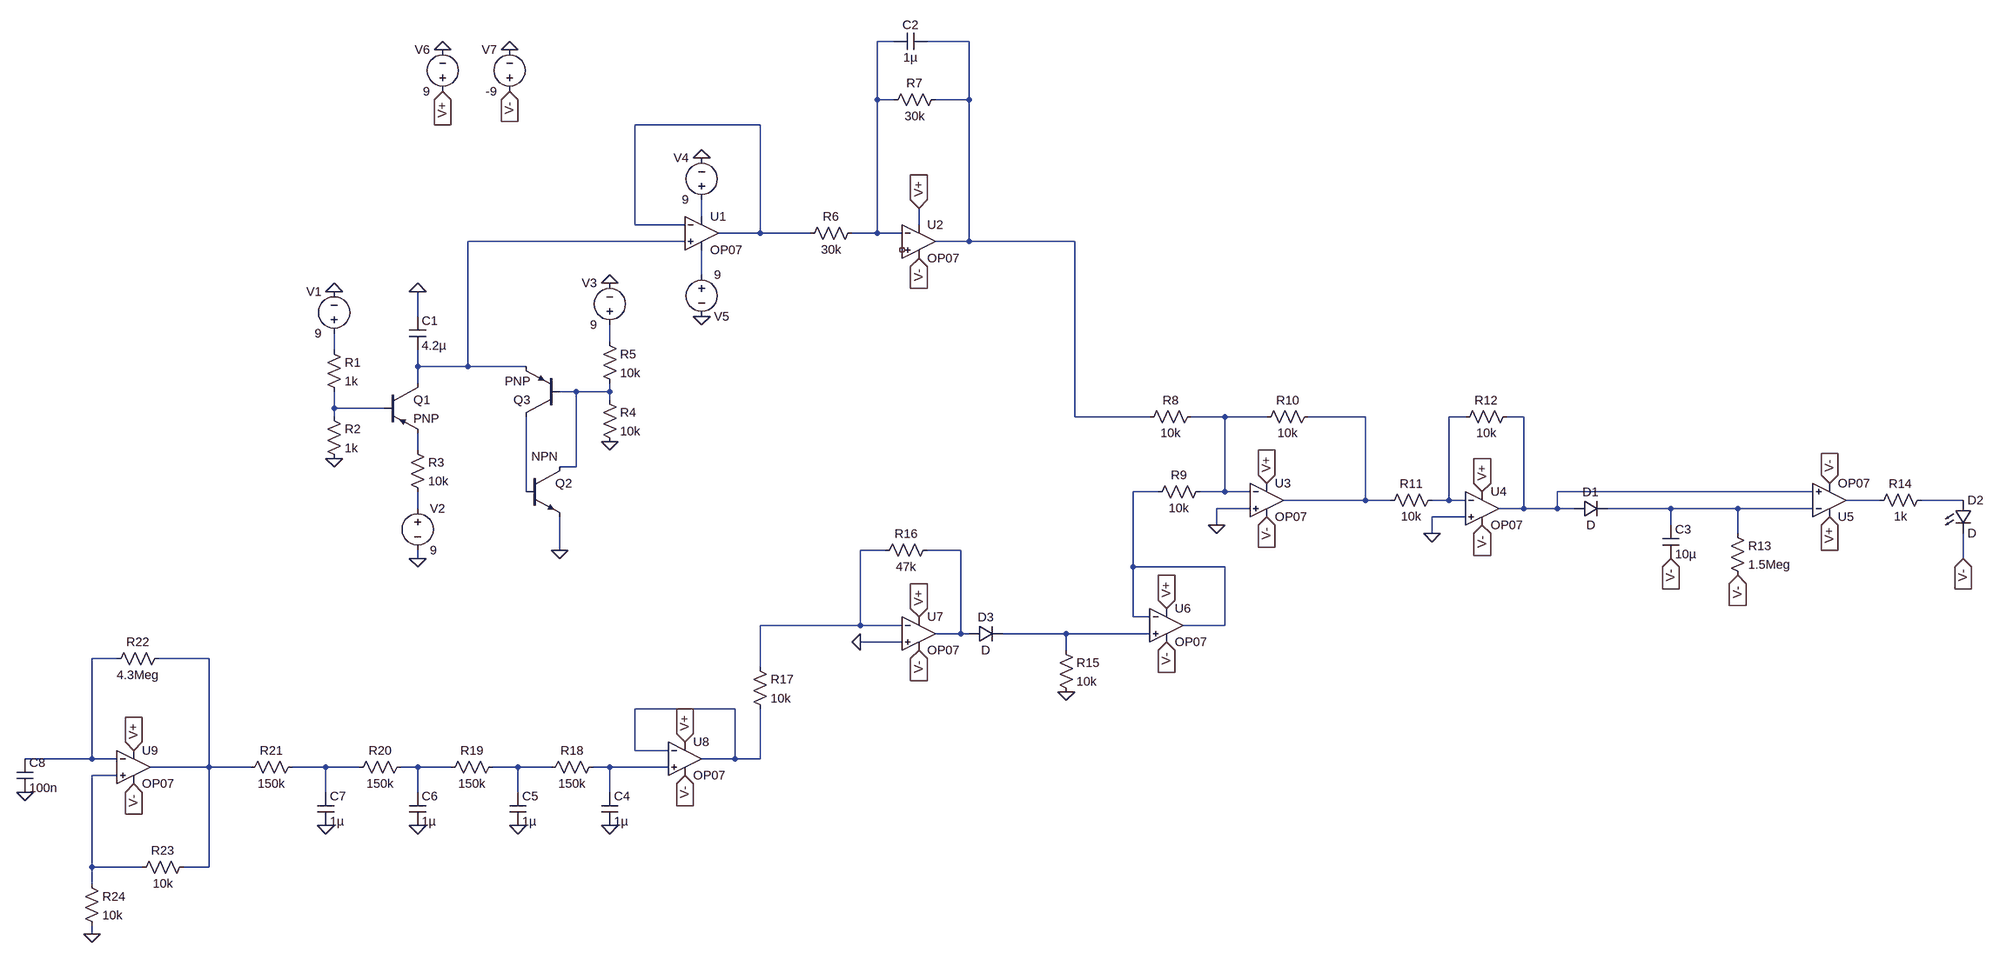
[diagram p0: schematic PulseSim.asc]
PulseSim.asc, the LTspice schematic file:
Version 4
SHEET 1 3496 1556
WIRE 1344 -176 1312 -176
WIRE 1488 -176 1408 -176
WIRE 1312 -64 1312 -176
WIRE 1344 -64 1312 -64
WIRE 1488 -64 1488 -176
WIRE 1488 -64 1424 -64
WIRE 1088 -16 848 -16
WIRE 976 160 976 128
WIRE 848 176 848 -16
WIRE 944 176 848 176
WIRE 1392 176 1392 144
WIRE 1088 192 1088 -16
WIRE 1088 192 1008 192
WIRE 1184 192 1088 192
WIRE 1312 192 1312 -64
WIRE 1312 192 1264 192
WIRE 1360 192 1312 192
WIRE 944 208 528 208
WIRE 1488 208 1488 -64
WIRE 1488 208 1424 208
WIRE 1712 208 1488 208
WIRE 976 272 976 224
WIRE 432 352 432 304
WIRE 800 400 800 368
WIRE 272 416 272 384
WIRE 432 448 432 416
WIRE 528 448 528 208
WIRE 528 448 432 448
WIRE 640 448 528 448
WIRE 432 480 432 448
WIRE 736 496 704 496
WIRE 800 496 800 480
WIRE 800 496 736 496
WIRE 800 512 800 496
WIRE 272 528 272 496
WIRE 368 528 272 528
WIRE 272 544 272 528
WIRE 1712 544 1712 208
WIRE 1856 544 1712 544
WIRE 2000 544 1936 544
WIRE 2080 544 2000 544
WIRE 2272 544 2160 544
WIRE 2464 544 2432 544
WIRE 2576 544 2544 544
WIRE 432 608 432 576
WIRE 736 640 736 496
WIRE 736 640 704 640
WIRE 640 688 640 544
WIRE 1872 688 1824 688
WIRE 2000 688 2000 544
WIRE 2000 688 1952 688
WIRE 2048 688 2000 688
WIRE 3136 688 2640 688
WIRE 2272 704 2272 544
WIRE 2272 704 2112 704
WIRE 2320 704 2272 704
WIRE 2432 704 2432 544
WIRE 2432 704 2400 704
WIRE 2464 704 2432 704
WIRE 3264 704 3200 704
WIRE 3424 704 3344 704
WIRE 432 720 432 688
WIRE 2048 720 1984 720
WIRE 2576 720 2576 544
WIRE 2576 720 2528 720
WIRE 2640 720 2640 688
WIRE 2640 720 2576 720
WIRE 2672 720 2640 720
WIRE 2864 720 2736 720
WIRE 2992 720 2864 720
WIRE 3136 720 2992 720
WIRE 2464 736 2400 736
WIRE 1984 752 1984 720
WIRE 2864 752 2864 720
WIRE 2400 768 2400 736
WIRE 2992 768 2992 720
WIRE 704 800 704 736
WIRE 1328 800 1280 800
WIRE 1472 800 1408 800
WIRE 432 816 432 800
WIRE 3424 816 3424 768
WIRE 1824 832 1824 688
WIRE 2000 832 1824 832
WIRE 1824 928 1824 832
WIRE 1856 928 1824 928
WIRE 1280 944 1280 800
WIRE 1280 944 1088 944
WIRE 1360 944 1280 944
WIRE 2000 944 2000 832
WIRE 2000 944 1920 944
WIRE 1472 960 1472 800
WIRE 1472 960 1424 960
WIRE 1488 960 1472 960
WIRE 1696 960 1552 960
WIRE 1856 960 1696 960
WIRE 1360 976 1280 976
WIRE 1696 992 1696 960
WIRE -144 1008 -192 1008
WIRE 32 1008 -64 1008
WIRE 1088 1024 1088 944
WIRE 1040 1104 848 1104
WIRE 848 1184 848 1104
WIRE 912 1184 848 1184
WIRE -192 1200 -192 1008
WIRE -192 1200 -320 1200
WIRE -144 1200 -192 1200
WIRE 1040 1200 1040 1104
WIRE 1040 1200 976 1200
WIRE 1088 1200 1088 1104
WIRE 1088 1200 1040 1200
WIRE 32 1216 32 1008
WIRE 32 1216 -80 1216
WIRE 112 1216 32 1216
WIRE 256 1216 192 1216
WIRE 320 1216 256 1216
WIRE 432 1216 400 1216
WIRE 496 1216 432 1216
WIRE 624 1216 576 1216
WIRE 688 1216 624 1216
WIRE 800 1216 768 1216
WIRE 912 1216 800 1216
WIRE -144 1232 -192 1232
WIRE 256 1264 256 1216
WIRE 432 1264 432 1216
WIRE 624 1264 624 1216
WIRE 800 1264 800 1216
WIRE -192 1408 -192 1232
WIRE -96 1408 -192 1408
WIRE 32 1408 32 1216
WIRE 32 1408 -16 1408
WIRE -192 1440 -192 1408
WIRE -192 1536 -192 1520
FLAG 272 304 0
FLAG 272 624 0
FLAG 432 816 0
FLAG 432 304 0
FLAG 704 800 0
FLAG 800 288 0
FLAG 800 592 0
FLAG 976 48 0
FLAG 976 352 0
FLAG 1392 144 V+
IOPIN 1392 144 In
FLAG 480 -80 V+
IOPIN 480 -80 In
FLAG 480 -160 0
FLAG 2080 672 V+
IOPIN 2080 672 In
FLAG 1984 752 0
FLAG 2400 768 0
FLAG 2496 688 V+
IOPIN 2496 688 In
FLAG 608 -80 V-
IOPIN 608 -80 In
FLAG 608 -160 0
FLAG 1392 240 V-
IOPIN 1392 240 In
FLAG 2080 736 V-
IOPIN 2080 736 In
FLAG 2496 752 V-
IOPIN 2496 752 In
FLAG 2864 816 V-
IOPIN 2864 816 In
FLAG 2992 848 V-
IOPIN 2992 848 In
FLAG 3168 672 V-
IOPIN 3168 672 In
FLAG 3168 736 V+
IOPIN 3168 736 In
FLAG 3424 816 V-
IOPIN 3424 816 In
FLAG 1888 912 V+
IOPIN 1888 912 In
FLAG 1888 976 V-
IOPIN 1888 976 In
FLAG 1696 1072 0
FLAG 1392 928 V+
IOPIN 1392 928 In
FLAG 1392 992 V-
IOPIN 1392 992 In
FLAG 1280 976 0
FLAG 944 1168 V+
IOPIN 944 1168 In
FLAG 944 1232 V-
IOPIN 944 1232 In
FLAG 800 1328 0
FLAG 432 1328 0
FLAG 256 1328 0
FLAG 624 1328 0
FLAG -112 1184 V+
IOPIN -112 1184 In
FLAG -112 1248 V-
IOPIN -112 1248 In
FLAG -192 1536 0
FLAG -320 1264 0
SYMBOL voltage 272 400 R180
WINDOW 0 24 96 Left 2
WINDOW 3 24 16 Left 2
WINDOW 123 0 0 Left 0
WINDOW 39 0 0 Left 0
SYMATTR InstName V1
SYMATTR Value 9
SYMBOL res 256 400 R0
SYMATTR InstName R1
SYMATTR Value 1k
SYMBOL res 256 528 R0
SYMATTR InstName R2
SYMATTR Value 1k
SYMBOL pnp 368 480 R0
SYMATTR InstName Q1
SYMBOL res 416 592 R0
SYMATTR InstName R3
SYMATTR Value 10k
SYMBOL voltage 432 704 R0
WINDOW 123 0 0 Left 0
WINDOW 39 0 0 Left 0
SYMATTR InstName V2
SYMATTR Value 9
SYMBOL cap 416 352 R0
SYMATTR InstName C1
SYMATTR Value 4.2µ
SYMBOL npn 640 640 R0
WINDOW 3 10 -20 Left 2
SYMATTR InstName Q2
SYMBOL pnp2 704 544 R180
SYMATTR InstName Q3
SYMBOL res 784 496 R0
SYMATTR InstName R4
SYMATTR Value 10k
SYMBOL res 784 384 R0
SYMATTR InstName R5
SYMATTR Value 10k
SYMBOL voltage 800 384 R180
WINDOW 0 24 96 Left 2
WINDOW 3 24 16 Left 2
WINDOW 123 0 0 Left 0
WINDOW 39 0 0 Left 0
SYMATTR InstName V3
SYMATTR Value 9
SYMBOL Opamps\\OP07 976 128 R0
SYMATTR InstName U1
SYMBOL voltage 976 144 R180
WINDOW 0 24 96 Left 2
WINDOW 3 24 16 Left 2
WINDOW 123 0 0 Left 0
WINDOW 39 0 0 Left 0
SYMATTR InstName V4
SYMATTR Value 9
SYMBOL voltage 976 256 R0
WINDOW 0 24 96 Left 2
WINDOW 3 24 16 Left 2
WINDOW 123 0 0 Left 0
WINDOW 39 0 0 Left 0
SYMATTR InstName V5
SYMATTR Value 9
SYMBOL res 1280 176 R90
WINDOW 0 0 56 VBottom 2
WINDOW 3 32 56 VTop 2
SYMATTR InstName R6
SYMATTR Value 30k
SYMBOL Opamps\\OP07 1392 144 R0
SYMATTR InstName U2
SYMBOL res 1440 -80 R90
WINDOW 0 0 56 VBottom 2
WINDOW 3 32 56 VTop 2
SYMATTR InstName R7
SYMATTR Value 30k
SYMBOL cap 1408 -192 R90
WINDOW 0 0 32 VBottom 2
WINDOW 3 32 32 VTop 2
SYMATTR InstName C2
SYMATTR Value 1µ
SYMBOL voltage 480 -64 R180
WINDOW 0 24 96 Left 2
WINDOW 3 24 16 Left 2
WINDOW 123 0 0 Left 0
WINDOW 39 0 0 Left 0
SYMATTR InstName V6
SYMATTR Value 9
SYMBOL res 1952 528 R90
WINDOW 0 0 56 VBottom 2
WINDOW 3 32 56 VTop 2
SYMATTR InstName R8
SYMATTR Value 10k
SYMBOL Opamps\\OP07 2080 640 R0
SYMATTR InstName U3
SYMBOL res 1968 672 R90
WINDOW 0 0 56 VBottom 2
WINDOW 3 32 56 VTop 2
SYMATTR InstName R9
SYMATTR Value 10k
SYMBOL res 2176 528 R90
WINDOW 0 0 56 VBottom 2
WINDOW 3 32 56 VTop 2
SYMATTR InstName R10
SYMATTR Value 10k
SYMBOL res 2416 688 R90
WINDOW 0 0 56 VBottom 2
WINDOW 3 32 56 VTop 2
SYMATTR InstName R11
SYMATTR Value 10k
SYMBOL Opamps\\OP07 2496 656 R0
SYMATTR InstName U4
SYMBOL res 2560 528 R90
WINDOW 0 0 56 VBottom 2
WINDOW 3 32 56 VTop 2
SYMATTR InstName R12
SYMATTR Value 10k
SYMBOL diode 2672 736 R270
WINDOW 0 32 32 VTop 2
WINDOW 3 0 32 VBottom 2
SYMATTR InstName D1
SYMBOL cap 2848 752 R0
SYMATTR InstName C3
SYMATTR Value 10µ
SYMBOL res 2976 752 R0
SYMATTR InstName R13
SYMATTR Value 1.5Meg
SYMBOL voltage 608 -64 R180
WINDOW 0 24 96 Left 2
WINDOW 3 24 16 Left 2
WINDOW 123 0 0 Left 0
WINDOW 39 0 0 Left 0
SYMATTR InstName V7
SYMATTR Value -9
SYMBOL Opamps\\OP07 3168 768 M180
SYMATTR InstName U5
SYMBOL res 3360 688 R90
WINDOW 0 0 56 VBottom 2
WINDOW 3 32 56 VTop 2
SYMATTR InstName R14
SYMATTR Value 1k
SYMBOL LED 3408 704 R0
SYMATTR InstName D2
SYMBOL Opamps\\OP07 1888 880 R0
SYMATTR InstName U6
SYMBOL res 1680 976 R0
SYMATTR InstName R15
SYMATTR Value 10k
SYMBOL diode 1488 976 R270
WINDOW 0 32 32 VTop 2
WINDOW 3 0 32 VBottom 2
SYMATTR InstName D3
SYMBOL Opamps\\OP07 1392 896 R0
SYMATTR InstName U7
SYMBOL res 1424 784 R90
WINDOW 0 0 56 VBottom 2
WINDOW 3 32 56 VTop 2
SYMATTR InstName R16
SYMATTR Value 47k
SYMBOL res 1072 1008 R0
SYMATTR InstName R17
SYMATTR Value 10k
SYMBOL Opamps\\OP07 944 1136 R0
SYMATTR InstName U8
SYMBOL cap 784 1264 R0
SYMATTR InstName C4
SYMATTR Value 1µ
SYMBOL cap 608 1264 R0
SYMATTR InstName C5
SYMATTR Value 1µ
SYMBOL cap 416 1264 R0
SYMATTR InstName C6
SYMATTR Value 1µ
SYMBOL cap 240 1264 R0
SYMATTR InstName C7
SYMATTR Value 1µ
SYMBOL res 784 1200 R90
WINDOW 0 0 56 VBottom 2
WINDOW 3 32 56 VTop 2
SYMATTR InstName R18
SYMATTR Value 150k
SYMBOL res 592 1200 R90
WINDOW 0 0 56 VBottom 2
WINDOW 3 32 56 VTop 2
SYMATTR InstName R19
SYMATTR Value 150k
SYMBOL res 416 1200 R90
WINDOW 0 0 56 VBottom 2
WINDOW 3 32 56 VTop 2
SYMATTR InstName R20
SYMATTR Value 150k
SYMBOL res 208 1200 R90
WINDOW 0 0 56 VBottom 2
WINDOW 3 32 56 VTop 2
SYMATTR InstName R21
SYMATTR Value 150k
SYMBOL Opamps\\OP07 -112 1152 R0
SYMATTR InstName U9
SYMBOL res -48 992 R90
WINDOW 0 0 56 VBottom 2
WINDOW 3 32 56 VTop 2
SYMATTR InstName R22
SYMATTR Value 4.3Meg
SYMBOL res 0 1392 R90
WINDOW 0 0 56 VBottom 2
WINDOW 3 32 56 VTop 2
SYMATTR InstName R23
SYMATTR Value 10k
SYMBOL res -208 1424 R0
SYMATTR InstName R24
SYMATTR Value 10k
SYMBOL cap -336 1200 R0
SYMATTR InstName C8
SYMATTR Value 100n

The netlist it stands for:
* PulseSim.asc
V1 N008 0 9
R1 N008 N010 1k
R2 N010 0 1k
Q1 N005 N010 N015 0 PNP
R3 N015 N020 10k
V2 N020 0 9
C1 0 N005 4.2µ
Q2 N009 N016 0 0 NPN
Q3 N016 N009 N005 0 PNP
R4 N009 0 10k
R5 N007 N009 10k
V3 N007 0 9
XU1 N005 N003 N004 N006 N003 LT1001  ; OP07, pins In+ In- V+ V- OUT
V4 N004 0 9
V5 N006 0 9
R6 N001 N003 30k
XU2 NC_01 N001 V+ V- N002 LT1001  ; OP07, pins In+ In- V+ V- OUT
R7 N002 N001 30k
C2 N002 N001 1µ
V6 V+ 0 9
R8 N011 N002 10k
XU3 0 N011 V+ V- N012 LT1001  ; OP07, pins In+ In- V+ V- OUT
R9 N011 N017 10k
R10 N012 N011 10k
R11 N013 N012 10k
XU4 0 N013 V+ V- N014 LT1001  ; OP07, pins In+ In- V+ V- OUT
R12 N014 N013 10k
D1 N014 N021 D
C3 N021 V- 10µ
R13 N021 V- 1.5Meg
V7 V- 0 -9
XU5 N014 N021 V+ V- N018 LT1001  ; OP07, pins In+ In- V+ V- OUT
R14 N019 N018 1k
D2 N019 V- D
XU6 N024 N017 V+ V- N017 LT1001  ; OP07, pins In+ In- V+ V- OUT
R15 N024 0 10k
D3 N023 N024 D
XU7 0 N022 V+ V- N023 LT1001  ; OP07, pins In+ In- V+ V- OUT
R16 N023 N022 47k
R17 N022 N027 10k
XU8 N031 N027 V+ V- N027 LT1001  ; OP07, pins In+ In- V+ V- OUT
C4 N031 0 1µ
C5 N030 0 1µ
C6 N029 0 1µ
C7 N028 0 1µ
R18 N031 N030 150k
R19 N030 N029 150k
R20 N029 N028 150k
R21 N028 N026 150k
XU9 N032 N025 V+ V- N026 LT1001  ; OP07, pins In+ In- V+ V- OUT
R22 N026 N025 4.3Meg
R23 N026 N032 10k
R24 N032 0 10k
C8 N025 0 100n
.model D D
.lib standard.dio
.model NPN NPN
.model PNP PNP
.lib standard.bjt
.lib LTC.lib
.backanno
.end